# Altium schematic sheet MAX96717_EVB_revC.SchDoc
size C; SheetNumber: 1; SheetTotal: 4
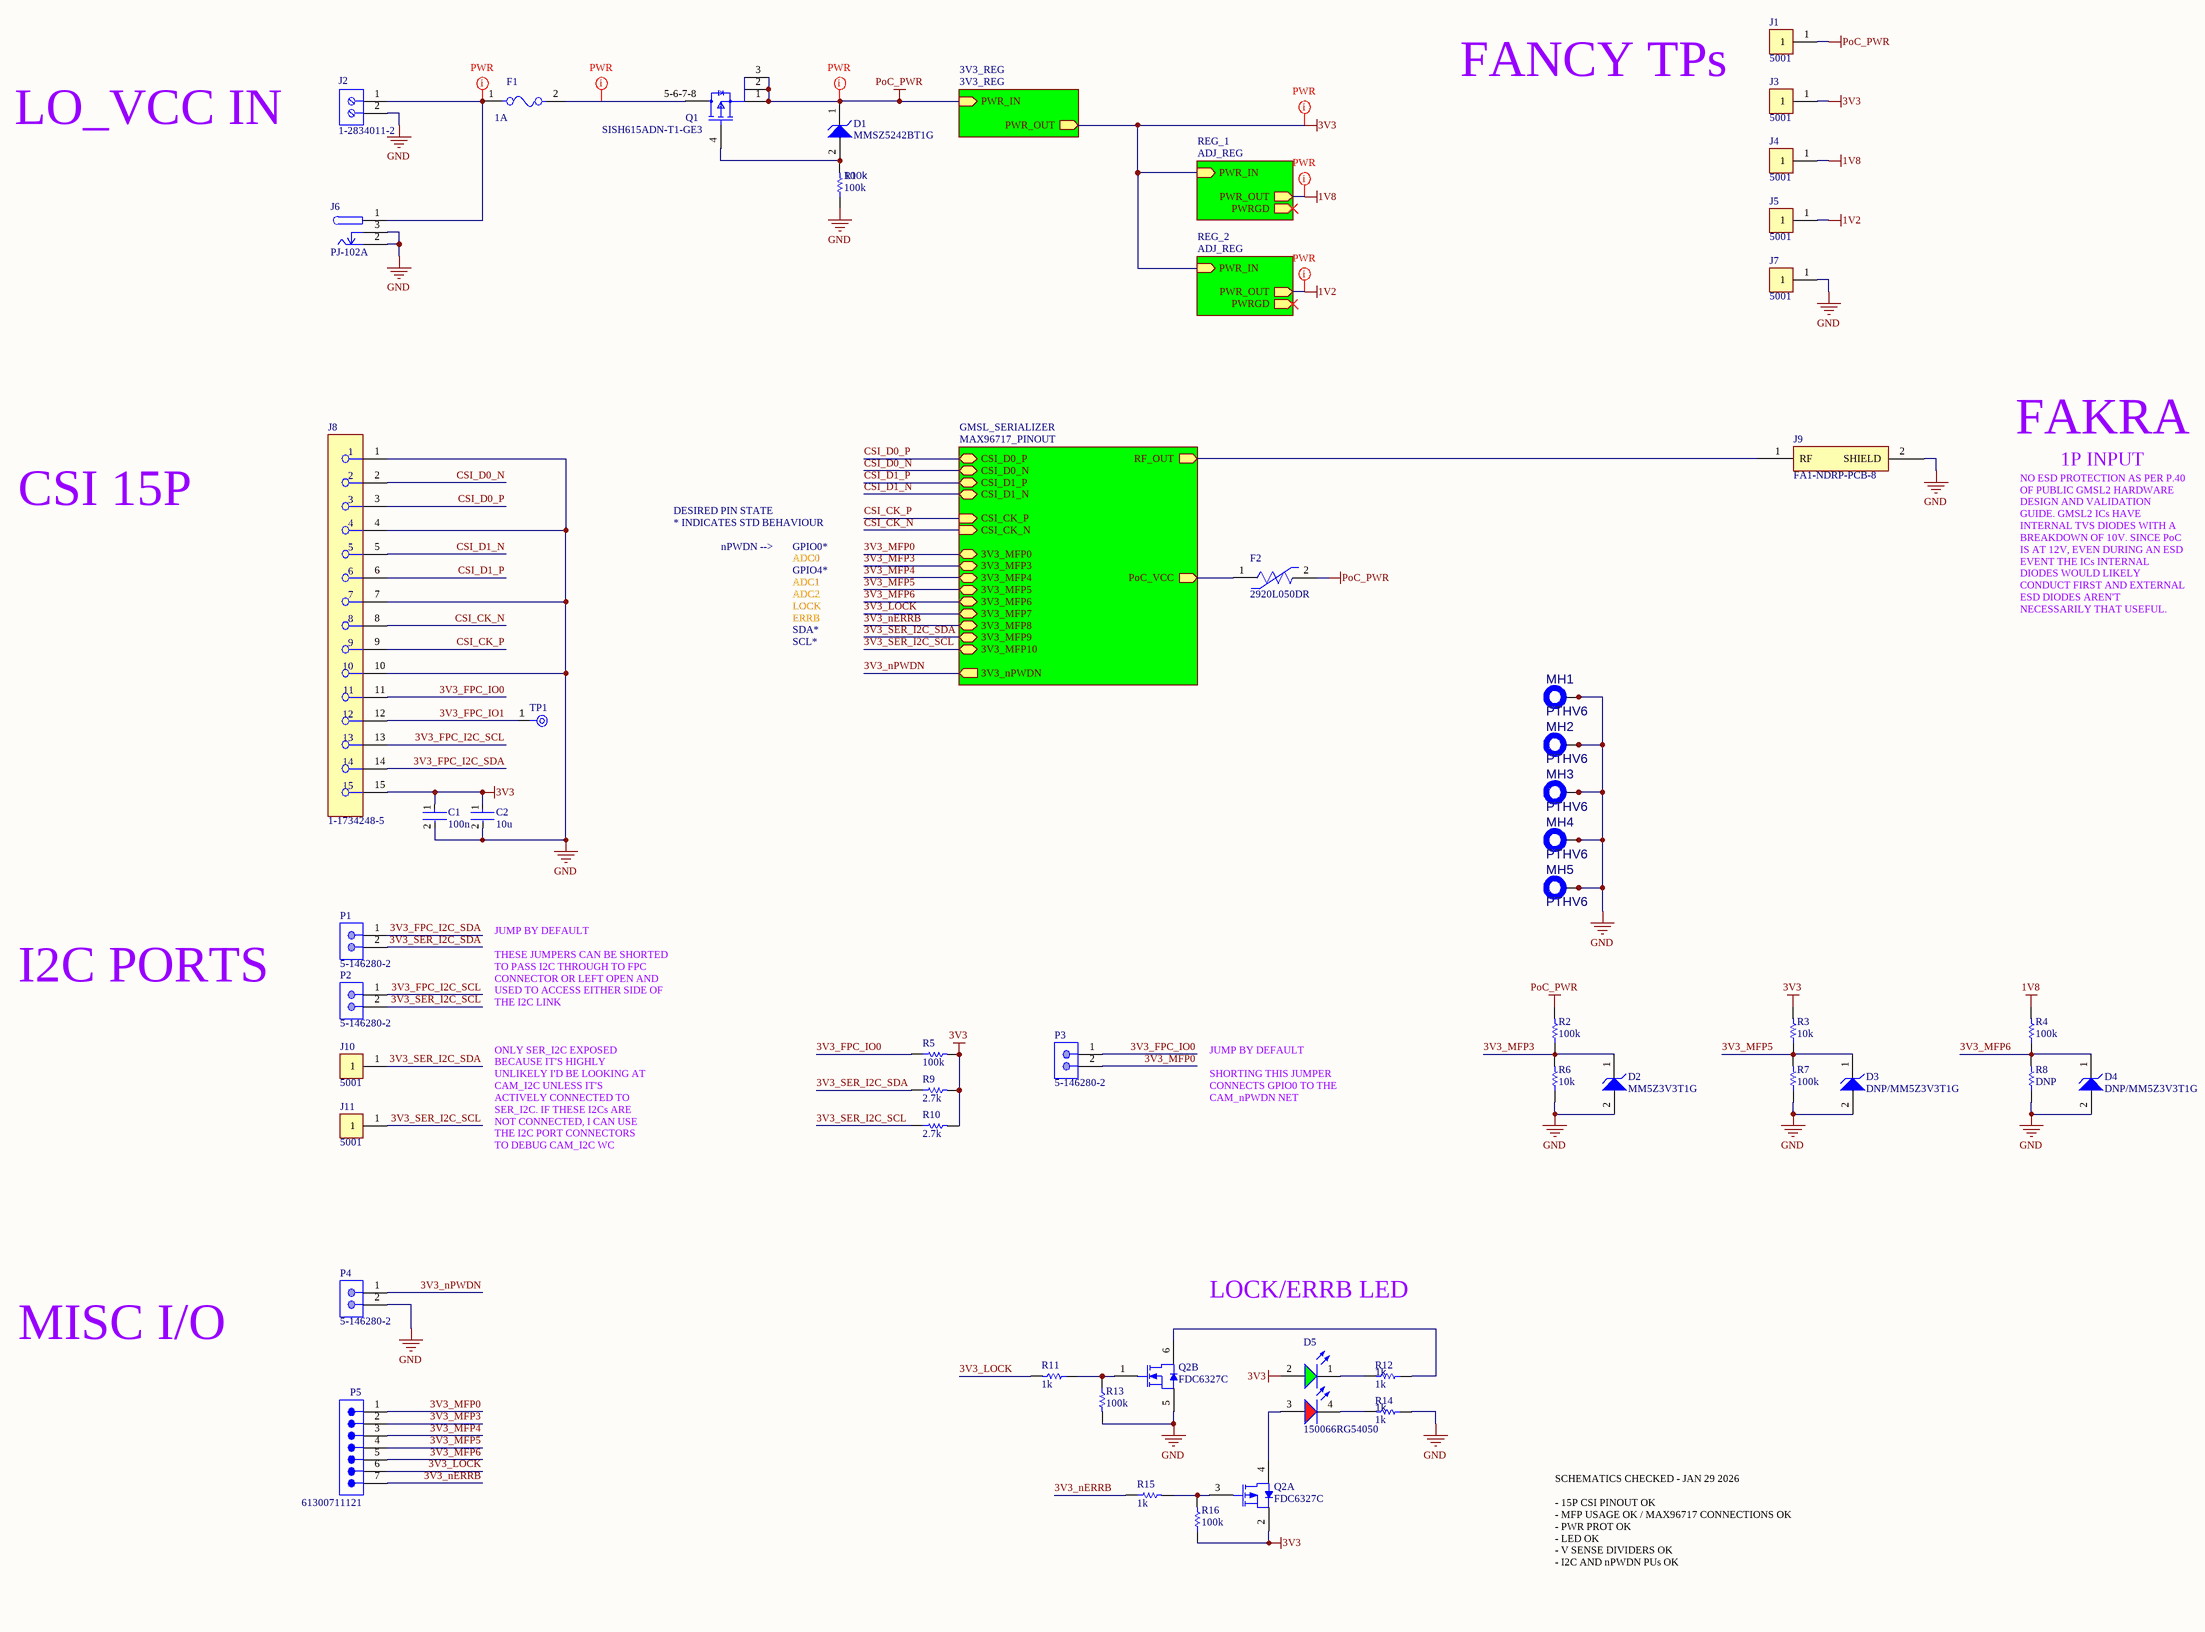
[diagram p0: MAX96717_EVB_revC.SchDoc]

## Parts
C1  100n  [FP-0402-L_1_0_0_05-W_0_5-IPC_A]
C2  10u  [FP-0402-L_1_0_0_05-W_0_5-IPC_A]
D1  MMSZ5242BT1G  [ONSC-SOD-123-2-425-04_V]
D2  MM5Z3V3T1G  [ONSC-SOD-523-2-502-01_V]
D3  DNP/MM5Z3V3T1G  [ONSC-SOD-523-2-502-01_V]
D4  DNP/MM5Z3V3T1G  [ONSC-SOD-523-2-502-01_V]
D5  150066RG54050  [WL-SBCD_0606]
F1  1A  [FP-SF-1206FP-MFG]
F2  2920L050DR  [FP-2920L050DR-MFG]
J1  5001  [FP-5001-MFG]
J2  1-2834011-2  [1-2834011-2-Footprint-1]
J3  5001  [FP-5001-MFG]
J4  5001  [FP-5001-MFG]
J5  5001  [FP-5001-MFG]
J6  PJ-102A  [FP-PJ-102A-MFG]
J7  5001  [FP-5001-MFG]
J8  1-1734248-5  [FP-1-1734248-5-MFG]
J9  FA1-NDRP-PCB-8  [FA1-NDRP-PCB-8-Footprint-1]
J10  5001  [FP-5001-MFG]
J11  5001  [FP-5001-MFG]
MH1  PTHV6  [PTHV6 M2]  (net tie, no BOM)
MH2  PTHV6  [PTHV6 M2]  (net tie, no BOM)
MH3  PTHV6  [PTHV6 M2]  (net tie, no BOM)
MH4  PTHV6  [PTHV6 M2]  (net tie, no BOM)
MH5  PTHV6  [PTHV6 M2]  (net tie, no BOM)
P1  5-146280-2  [TECO-5-146280-2_V]
P2  5-146280-2  [TECO-5-146280-2_V]
P3  5-146280-2  [TECO-5-146280-2_V]
P4  5-146280-2  [TECO-5-146280-2_V]
P5  61300711121  [61300711121]
Q1  SISH615ADN-T1-GE3  [SISH615ADN-T1-GE3-Footprint-1]
Q2  FDC6327C  [FAIR-SOT23-6_V]  (parts A,B of 2)
R1  100k  [R0603B]
R2  100k  [R0603B]
R3  10k  [R0603B]
R4  100k  [R0603B]
R5  100k  [R0603B]
R6  10k  [R0603B]
R7  100k  [R0603B]
R8  DNP  [R0603B]
R9  2.7k  [R0603B]
R10  2.7k  [R0603B]
R11  1k  [R0603B]
R12  1k  [R0603B]
R13  100k  [R0603B]
R14  1k  [R0603B]
R15  1k  [R0603B]
R16  100k  [R0603B]
TP1  TPAD6R  [New footprint 1]  (value not drawn)  (no BOM)

## Sub-sheets
3V3_REG = 3V3_REG: PWR_IN (in), PWR_OUT (out)
GMSL_SERIALIZER = MAX96717_PINOUT: CSI_D0_P (bidir), CSI_D0_N (bidir), CSI_D1_P (bidir), CSI_D1_N (bidir), CSI_CK_P (in), CSI_CK_N (in), RF_OUT (out), PoC_VCC (out), 3V3_MFP0 (bidir), 3V3_MFP3 (bidir), 3V3_MFP4 (bidir), 3V3_MFP5 (bidir), 3V3_MFP6 (bidir), 3V3_MFP7 (bidir), 3V3_MFP8 (bidir), 3V3_MFP9 (bidir), 3V3_MFP10 (bidir), 3V3_nPWDN (out)
REG_1 = ADJ_REG: PWR_OUT (out), PWR_IN (in), PWRGD (out)
REG_2 = ADJ_REG: PWR_OUT (out), PWR_IN (in), PWRGD (out)

## Nets
1V2: J5.1 ; sheet REG_2/PWR_OUT
1V8: J4.1 R4.2 ; sheet REG_1/PWR_OUT
3V3: C1.1 C2.1 D5.2(A) J3.1 J8.15 Q2.2(S) R3.2 R5.2 R9.2 R10.2 R16.1 ; sheet 3V3_REG/PWR_OUT, sheet REG_1/PWR_IN, sheet REG_2/PWR_IN
GND: C1.2 C2.2 D2.2(A) D3.2(A) D4.2(A) J2.2 J6.2 J6.3 J7.1 J8.1 J8.4 J8.7 J8.10 J9.2(SHIELD) MH1.1(MH) MH1.2(V1) MH1.3(V2) MH1.4(V3) MH1.5(V4) MH1.6(V5) MH1.7(V6) MH2.1(MH) MH2.2(V1) MH2.3(V2) MH2.4(V3) MH2.5(V4) MH2.6(V5) MH2.7(V6) MH3.1(MH) MH3.2(V1) MH3.3(V2) MH3.4(V3) MH3.5(V4) MH3.6(V5) MH3.7(V6) MH4.1(MH) MH4.2(V1) MH4.3(V2) MH4.4(V3) MH4.5(V4) MH4.6(V5) MH4.7(V6) MH5.1(MH) MH5.2(V1) MH5.3(V2) MH5.4(V3) MH5.5(V4) MH5.6(V5) MH5.7(V6) P4.2 Q2.5(S) R1.1 R6.1 R7.1 R8.1 R13.2 R14.1
PoC_PWR: D1.1(K) F2.2 J1.1 Q1.1(S) Q1.2(S) Q1.3(S) R2.2 ; sheet 3V3_REG/PWR_IN
3V3_FPC_I2C_SCL: J8.13 P2.1
3V3_FPC_I2C_SDA: J8.14 P1.1
3V3_FPC_IO0: J8.11 P3.1 R5.1
3V3_FPC_IO1: J8.12 TP1.1(TP)
3V3_LOCK: P5.6 R11.2 ; sheet GMSL_SERIALIZER/3V3_MFP7
3V3_MFP0: P3.2 P5.1 ; sheet GMSL_SERIALIZER/3V3_MFP0
3V3_MFP3: D2.1(K) P5.2 R2.1 R6.2 ; sheet GMSL_SERIALIZER/3V3_MFP3
3V3_MFP4: P5.3 ; sheet GMSL_SERIALIZER/3V3_MFP4
3V3_MFP5: D3.1(K) P5.4 R3.1 R7.2 ; sheet GMSL_SERIALIZER/3V3_MFP5
3V3_MFP6: D4.1(K) P5.5 R4.1 R8.2 ; sheet GMSL_SERIALIZER/3V3_MFP6
3V3_nERRB: P5.7 R15.1 ; sheet GMSL_SERIALIZER/3V3_MFP8
3V3_nPWDN: P4.1 ; sheet GMSL_SERIALIZER/3V3_nPWDN
3V3_SER_I2C_SCL: J11.1 P2.2 R10.1 ; sheet GMSL_SERIALIZER/3V3_MFP10
3V3_SER_I2C_SDA: J10.1 P1.2 R9.1 ; sheet GMSL_SERIALIZER/3V3_MFP9
CSI_CK_N: J8.8 ; sheet GMSL_SERIALIZER/CSI_CK_N
CSI_CK_P: J8.9 ; sheet GMSL_SERIALIZER/CSI_CK_P
CSI_D0_N: J8.2 ; sheet GMSL_SERIALIZER/CSI_D0_N
CSI_D0_P: J8.3 ; sheet GMSL_SERIALIZER/CSI_D0_P
CSI_D1_N: J8.5 ; sheet GMSL_SERIALIZER/CSI_D1_N
CSI_D1_P: J8.6 ; sheet GMSL_SERIALIZER/CSI_D1_P
NetD1_2: D1.2(A) Q1.4(G) R1.2
NetD5_1: D5.1(K) R12.2
NetD5_3: D5.3(A) Q2.4(D)
NetD5_4: D5.4(K) R14.2
NetF1_1: F1.1 J2.1 J6.1
NetF1_2: F1.2 Q1.5-6-7-8(D)
NetF2_1: F2.1 ; sheet GMSL_SERIALIZER/PoC_VCC
NetJ9_1: J9.1(RF) ; sheet GMSL_SERIALIZER/RF_OUT
NetQ2_1: Q2.1(G) R11.1 R13.1
NetQ2_3: Q2.3(G) R15.2 R16.2
NetQ2_6: Q2.6(D) R12.1

## Layout directives
net class PWR: 1V2, 1V8, 3V3, NetF1_1, NetF1_2, PoC_PWR

## Notes on the sheet
- FANCY TPs
- LO_VCC IN
- FAKRA
- 1P INPUT
- CSI 15P
- DESIRED PIN STATE
- * INDICATES STD BEHAVIOUR
- nPWDN -->
- GPIO0*
- ADC0
- GPIO4*
- ADC1
- ADC2
- LOCK
- ERRB
- SDA*
- SCL*
- NO ESD PROTECTION AS PER P.40 OF PUBLIC GMSL2 HARDWARE DESIGN AND VALIDATION GUIDE. GMSL2 ICs HAVE INTERNAL TVS DIODES WITH A BREAKDOWN OF 10V. SINCE PoC IS AT 12V, EVEN DURING AN ESD EVENT THE ICs INTERNAL DIODES WOULD LIKELY CONDUCT FIRST AND EXTERNAL ESD DIODES AREN'T NECESSARILY THAT USEFUL.
- I2C PORTS
- JUMP BY DEFAULT
  THESE JUMPERS CAN BE SHORTED TO PASS I2C THROUGH TO FPC CONNECTOR OR LEFT OPEN AND USED TO ACCESS EITHER SIDE OF THE I2C LINK
- JUMP BY DEFAULT
  SHORTING THIS JUMPER CONNECTS GPIO0 TO THE CAM_nPWDN NET
- ONLY SER_I2C EXPOSED BECAUSE IT'S HIGHLY UNLIKELY I'D BE LOOKING AT CAM_I2C UNLESS IT'S ACTIVELY CONNECTED TO SER_I2C. IF THESE I2Cs ARE NOT CONNECTED, I CAN USE THE I2C PORT CONNECTORS TO DEBUG CAM_I2C WC
- LOCK/ERRB LED
- MISC I/O
- SCHEMATICS CHECKED - JAN 29 2026
  - 15P CSI PINOUT OK
  - MFP USAGE OK / MAX96717 CONNECTIONS OK
  - PWR PROT OK
  - LED OK
  - V SENSE DIVIDERS OK
  - I2C AND nPWDN PUs OK

## Library data of the parts
C1 C2 = CMP-001-00058-1: LARGE PADS, 0402 CAP, CHANGE COMMENT TO MATCH REAL P/N; Capacitor Type: Ceramic; Min Operating Temperature: -55°C; Mounting Technology: Surface Mount; Pins: 2; Case/Package: 0402; RoHS Compliant: Yes; Max Operating Temperature: 85°C
D1 = CMP-1060-00565-1: Zener Voltage Regulator, 500 mW, 2-Pin SOD-123, Pb-Free, Tape and Reel; Manufacturer: On Semiconductor; P Max (W): 0.5; VZ Typ (V): 12; PartNumber: MMSZ5242BT1G; PackageReference: SOD-123-2-425-04; ComponentLink3URL: http://www.onsemi.com/pub_link/Collateral/425-04.PDF; Mounting Technology: Surface Mount; ComponentLink2Description: Datasheet; ComponentLink1URL: http://www.onsemi.com/; ComponentLink3Description: Package Specification; PackageDescription: 2-Pin SOD, Body 1.6 x 2.69 mm; PackageVersion: Rev. G, 10/2009; ComponentLink1Description: Manufacturer URL; RoHS: Pb-Free; ComponentLink2URL: http://www.onsemi.com/pub_link/Collateral/MMSZ5221BT1-D.PDF; Packing: Tape and Reel; DatasheetVersion: Rev. 12
D2-D4 = CMP-1060-00750-1: Zener Voltage Regulator, 500 mW, 2-Pin SOD-523, Pb-Free, Tape and Reel; Manufacturer: On Semiconductor; P Max (W): 0.5; VZ Typ (V): 3.3; RoHS: Pb-Free; ComponentLink2Description: Datasheet; PackageReference: SOD-523-2-502-01; DatasheetVersion: Rev. 10; ComponentLink1Description: Manufacturer URL; PackageVersion: Rev. E, 09/2010; ComponentLink3URL: http://www.onsemi.com/pub_link/Collateral/502-01.PDF; ComponentLink2URL: http://www.onsemi.cn/pub_link/Collateral/MM5Z2V4T1-D.PDF; Mounting Technology: Surface Mount; PartNumber: MM5Z3V3T1G; Packing: Tape and Reel; PackageDescription: 2-Pin SOD, Body 1.2 x 0.8 mm; ComponentLink1URL: http://www.onsemi.com/; ComponentLink3Description: Package Specification
D5 = CMP-004-00040-2: Led, Red/Grn, 180Mcd/230Mcd, 624Nm/525Nm Rohs Compliant: Yes; Source: rgled.SchLib; Component Type: Standard; Design Item ID: CMP-004-00034-2; Pins: 4
F1 = CMP-07399-000013-1: FUSE BOARD MOUNT 2A 63VDC 1206; Voltage Rating (DC): 63V; Fuse Type: Board Mount (Cartridge Style Excluded); Approvals: UL; Mount: Surface Mount; Min Operating Temperature: -20°C; Max Operating Temperature: 105°C; Case Code (Imperial): 1206; Packaging: Cut Tape; Current Rating: 2A; RoHS Compliant: Yes; Series: SinglFuse™ SF-1206FP; Case Code (Metric): 3216; Case/Package: 1206
F2 = CMP-08606-000071-1: PTC RESET FUSE 60V 500MA 2920; Resistance: 1.4R; Trip Current: 1A; Power Dissipation: 1.5W; Time to Trip: 4s; Approvals: cULus; Current Rating: 10A; Operating Supply Voltage: 60V; Termination: SMD/SMT; Width: 5.44mm; Case/Package: 2920; Series: 2920L; Case Code (Imperial): 2920; Height: 1.25mm; Hold Current: 500mA; Terminal Material: Copper; Min Operating Temperature: -40°C; Package Quantity: 1500; Max Voltage Rating (DC): 60V; RoHS Compliant: Yes; Case Code (Metric): 7351; Lead Free: Lead Free; Max Operating Temperature: 85°C; Voltage Rating (DC): 60V; Working Voltage: 60V; Length: 7.98mm; REACH SVHC: No SVHC; Max Current Rating: 10A; Voltage Rating: 60V; Packaging: Tape and Reel
J1 J3-J5 J7 J10 J11 = CMP-2000-05181-2: PC TEST POINT MINIATURE BLACK; Body Material: Bronze; Plating: Silver; Inside Diameter: 1.27mm; Hole Diameter: 1.6mm; Number of Ports: 1; Outside Diameter: 2.54mm; Insulation: Insulated; Insulation Material: Nylon; Mount: Through Hole; RoHS Compliant: Yes; Series: THM; Height: 0.3inch; Termination: Through Hole; Material: Nylon; Packaging: Bulk; Contact Material: Bronze; REACH SVHC: No SVHC; Contact Plating: Silver; Orientation: Straight; Lead Free: Lead Free; Package Quantity: 100; Length: 7.62mm; Flammability Rating: UL94 V-0; Number of Contacts: 1; Diameter: 2.54mm; Housing Color: Black; Color: Black
J2 = CMP-002-00067-1: Barrier Strip Terminal Block; RoHS Compliant: Yes
J6 = CMP-12637-106234071-1: PJ-102A 2.0 x 6.5 mm, 2.5 A, Horizontal, Through Hole, Tapered Pins, Dc Power Jack Connector; Voltage Rating (DC): 24V; Number of Contacts: 3; Outside Diameter: 6.5mm; Gender: Male; Shielding: No; Insulation Resistance: 50MΩ; Current Rating: 2.5A; Inside Diameter: 2mm; Number of Conductors: 2; Housing Color: Black; RoHS: Compliant; Diameter: 2.1mm; Mount: Through Hole; Contact Plating: Nickel; NexarPartId: 106234071; Voltage Rating: 24V; Housing Material: Thermoplastic; Max Operating Temperature: 85°C; Color: Black; Contact Material: Copper, Nickel, Tin; Orientation: Horizontal; Packaging: Bulk; Flammability Rating: UL94 V-0; Schedule B: 8536695050, 8536695050; Contact Gender: Male; Lead Free: Lead Free; Termination: Through Hole; Min Operating Temperature: -25°C; Height: 11.2mm; Lifecycle Status: Production
J8 = CMP-03368-000001-1: CONN FPC VERT 15POS 1.00MM SMD; Manufacturer: TE; Conn Orientation: Vertical; Conn Gender: Female; Current Rating: 1A; Is Female: yes; Number Of Contacts: 15; Pitch: 1mm; Voltage Rating: 125V; ComponentLink2URL: https://www.te.com/commerce/DocumentDelivery/DDEController?Action=showdoc&DocId=Customer+Drawing%7F1734248%7FE1%7Fpdf%7FEnglish%7FENG_CD_1734248_E1__.pdf%7F1-1734248-5; Device Class L1: Connectors; Category: Conn; Package: 0; Lead Free: Yes; Digikey Description: CONN FPC VERT 15POS 1.00MM SMD; Height: 8mm; Manufacturer Part Number: 1-1734248-5; Temperature: -20°C to +85°C; Contact Material: Gold,Nickel; Device Class L3: unset; ComponentLink2Description: Datasheet; RoHS: TRUE; Temperature Range Low: -20°C; Octopart: https://octopart.com/1-1734248-5-te+connectivity-40620898; Device Class L2: FFC / FPC; Mouser Description: FFC & FPC Connectors 15P 1.0 FPC, Zip V/T SMT; Automotive: No; Temperature Range High: +85°C; Mounting Type: Surface Mount
J9 = CMP-002-00054-2: RF F Connector, Male, Board Mount, Solder Terminal, Plug; Connector Type: RF F CONNECTOR; RoHS Compliant: Yes; Mounting Technology: Board
MH1-MH5 = CMP-00028-00001-13: Plated mounting hole with 6 peripheral vias. This is a generic symbol that groups all relevant footprints.
P1-P4 = CMP-2000-07492-1: Male Header, Pitch 2.54 mm, 1 x 2 Position, Height 8.21 mm, Tail Length 3.05 mm, -65 to 105 degC, RoHS, Bulk; Manufacturer: TE Connectivity; Mating Connector Lock: No(Without); Number of Positions: 2; Pitch: 2.54mm; PCB Mounting Orientation: Vertical; Keyed: No; Case\/Package: 100; Mating Post Length: 0.23inch; High Temperature Housing: Yes; Max Current Rating: 5A; PCB Thickness: 0.063inch; PCB Mount Retention: Without; Approvals: CSA; Current Rating: 3A; Radiation Hardening: No; Length: 4.67mm; Contact Mating Length: 0.23inch; Connector Type: Header; Number of Rows: 1; Termination Post Length: 0.12inch; Board Standoff: No(Without); Max Operating Temperature: 105degC; Contact Shape: Square; Selectively Loaded: No(Without); Gasket: No(Without); Number of Contacts: 2; Contact Gender: Male; Mating Alignment: No(Without); Manufacturer URL: http://www.te.com/; Datasheet URL: http://www.te.com/commerce/DocumentDelivery/DDEController?Action=showdoc&DocId=Customer+Drawing%7F146280%7FH1%7Fpdf%7FEnglish%7FENG_CD_146280_H1.pdf%7F5-146280-2; Mount: ThroughHole; Orientation: Straight; Packaging: Carton; Package Reference: 5-146280-2; Package Quantity: 500; Stabilizers: No(Without); Row Spacing: 2.54mm; Contact Material: CopperAlloy; Panel Mount Retention: No(Without); Datasheet Version: Rev. H1, 08/2016; Housing Colour: Black; Colour: Black; Package Description: Male Header, Pitch 2.54 mm, 1 x 2 Position, Height 8.21 mm, Tail Length 3.05 mm; Contact Plating: Matte; Housing Material: Polymer; Contact Protection: No(Without); Min Operating Temperature: -65degC; Mounting Technology: ThroughHole; Flammability Rating: UL94V-0; RoHSCompliant: true; Termination: ThroughHole; Depth: 2.34mm; High Speed Serial Data Connector: No
P5 = CMP-1502-01074-4: THT Vertical Pin Header WR-PHD, Pitch 2.54 mm, Single Row, 7 pins; Number of Positions: 7; Pitch: 2.54mm; Gender: Male; Operating Supply Voltage: 250V; Contact Resistance: 20mΩ; Current Rating: 3A; Connector Type: Male Pin; Contact Mating Length: 5.9944mm; Number of Rows: 1; Packaging: Bulk; Contact Material: Copper; Orientation: Vertical; Color: Black; Mount: Through Hole; Termination: Solder; RoHS: Compliant; Lead Pitch: 2.54mm; Contact Plating: Gold; Number of Pins: 7; Number of Contacts: 7
Q1 = CMP-013-00018-2: Trans MOSFET P-CH 20V 22.1A 8-Pin PowerPAK 1212 EP T/R; Source: SISH615ADN-T1-GE3.SchLib; Design Item ID: CMP-013-00036-4; Component Type: Standard; Pins: 5
Q2 = CMP-2000-04939-1: Dual N & P-Channel 2.5 V Specified PowerTrench(TM) MOSFET, -55 to 150 degC, 6-Pin SOT-23, RoHS, Tape and Reel; Manufacturer: Fairchild; Typical Rise Time: 9@NChannel; Rad Hard: No; Maximum Drain Source Voltage: 20V; Typical Fall Time: 3@NChannel; Typical Turn-On Delay Time: 5@NChannel; Maximum Continuous Drain Current: 2.7@NChannel; Typical Turn-Off Delay Time: 12@NChannel; RDS-on: 80@4.5V@NChannel; Channel Mode: Enhancement; Maximum Gate Source Voltage: ±8V; Package Version: Rev. 5, 05/2015; Operating Temperature: -55to150degC; Packaging: Tape&Reel; Package Reference: SOT23-6; Package URL: https://www.fairchildsemi.com/package-drawings/MA/MA06A.pdf; Package Description: 6-Pin Small Outline Transistor, Body 2.9 x 1.6 mm, Pitch 0.95 mm; Manufacturer URL: https://www.fairchildsemi.com/; Channel Type: N; Datasheet Version: Rev. E, 07/2000; Package: 6SuperSOT; Datasheet URL: https://www.fairchildsemi.com/datasheets/FD/FDC6327C.pdf; Mounting: SurfaceMount; Category: MOSFET
R1 R2 R4 R5 R7 R11-R16 = CMP-009-00002-14: Resistor
  R1 R2 R4 R5 R7: Value: 100k
  R12 R14: Value: 1k
R3 R6 R8-R10 = CMP-009-00002-14: Resistor; Value: 100k
TP1 = CMP-00025-3: Test Point .6mm